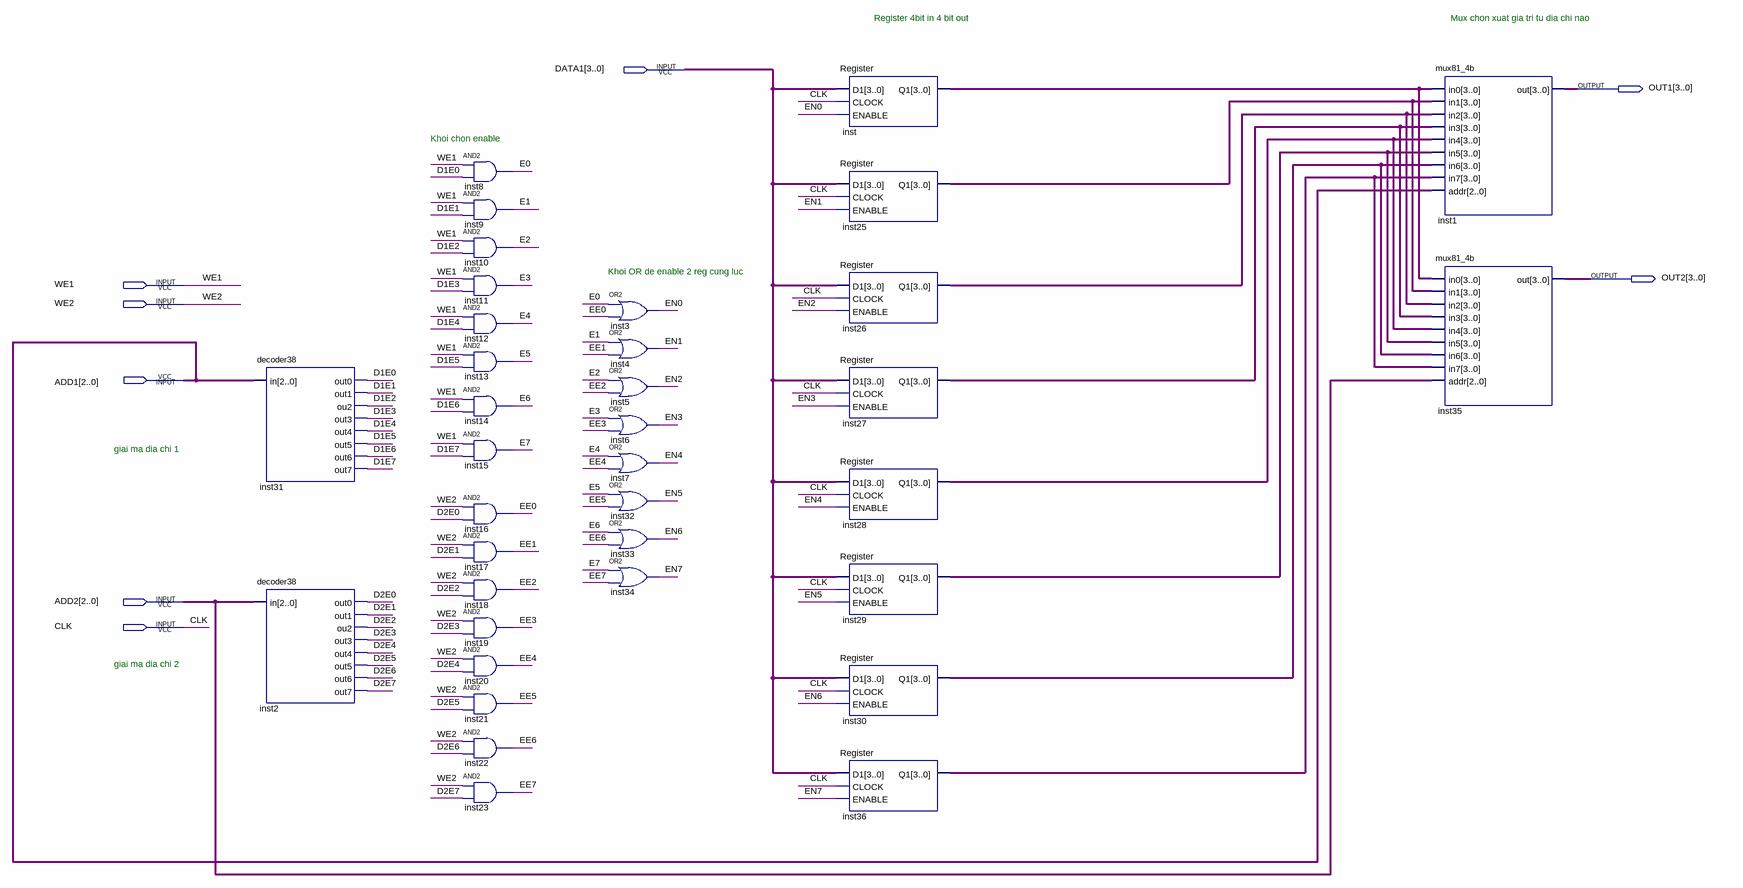
[diagram p0: schematic sheet]
// Quartus schematic Block3.bdf as structural Verilog: 36 symbols, 8 pins
module Block3 (
  input  [3:0] DATA1,
  input  WE1,
  input  WE2,
  input  [2:0] ADD1,
  input  [2:0] ADD2,
  input  CLK,
  output [3:0] OUT1,
  output [3:0] OUT2
);

  wire D1E0, D1E1, D1E2, D1E3, D1E4, D1E5, D1E6, D1E7, D2E0, D2E1, D2E2, D2E3, D2E4, D2E5, D2E6, D2E7, E0,
       E1, E2, E3, E4, E5, E6, E7, EE0, EE1, EE2, EE3, EE4, EE5, EE6, EE7, EN0, EN1, EN2, EN3, EN4, EN5, EN6,
       EN7;
  wire [3:0] inst25_q1, inst26_q1, inst27_q1, inst28_q1, inst29_q1, inst30_q1, inst36_q1, inst_q1;

  decoder38 inst31 (
    .in(ADD1), .out0(D1E0), .out1(D1E1), .ou2(D1E2), .out3(D1E3), .out4(D1E4), .out5(D1E5), .out6(D1E6),
    .out7(D1E7));
  decoder38 inst2 (
    .in(ADD2), .out0(D2E0), .out1(D2E1), .ou2(D2E2), .out3(D2E3), .out4(D2E4), .out5(D2E5), .out6(D2E6),
    .out7(D2E7));
  and inst8 (E0, WE1, D1E0);
  and inst9 (E1, WE1, D1E1);
  and inst10 (E2, WE1, D1E2);
  and inst11 (E3, WE1, D1E3);
  and inst12 (E4, WE1, D1E4);
  and inst13 (E5, WE1, D1E5);
  and inst14 (E6, WE1, D1E6);
  and inst15 (E7, WE1, D1E7);
  and inst16 (EE0, WE2, D2E0);
  and inst17 (EE1, WE2, D2E1);
  and inst18 (EE2, WE2, D2E2);
  and inst19 (EE3, WE2, D2E3);
  and inst20 (EE4, WE2, D2E4);
  and inst21 (EE5, WE2, D2E5);
  and inst22 (EE6, WE2, D2E6);
  and inst23 (EE7, WE2, D2E7);
  or inst3 (EN0, E0, EE0);
  or inst4 (EN1, E1, EE1);
  or inst5 (EN2, E2, EE2);
  or inst6 (EN3, E3, EE3);
  or inst7 (EN4, E4, EE4);
  or inst32 (EN5, E5, EE5);
  or inst33 (EN6, E6, EE6);
  or inst34 (EN7, E7, EE7);
  Register inst (.D1(DATA1), .CLOCK(CLK), .ENABLE(EN0), .Q1(inst_q1));
  Register inst25 (.D1(DATA1), .CLOCK(CLK), .ENABLE(EN1), .Q1(inst25_q1));
  Register inst26 (.D1(DATA1), .CLOCK(CLK), .ENABLE(EN2), .Q1(inst26_q1));
  Register inst27 (.D1(DATA1), .CLOCK(CLK), .ENABLE(EN3), .Q1(inst27_q1));
  Register inst28 (.D1(DATA1), .CLOCK(CLK), .ENABLE(EN4), .Q1(inst28_q1));
  Register inst29 (.D1(DATA1), .CLOCK(CLK), .ENABLE(EN5), .Q1(inst29_q1));
  Register inst30 (.D1(DATA1), .CLOCK(CLK), .ENABLE(EN6), .Q1(inst30_q1));
  Register inst36 (.D1(DATA1), .CLOCK(CLK), .ENABLE(EN7), .Q1(inst36_q1));
  mux81_4b inst1 (
    .in0(inst_q1), .in1(inst25_q1), .in2(inst26_q1), .in3(inst27_q1), .in4(inst28_q1), .in5(inst29_q1),
    .in6(inst30_q1), .in7(inst36_q1), .addr(ADD1), .out(OUT1));
  mux81_4b inst35 (
    .in0(inst_q1), .in1(inst25_q1), .in2(inst26_q1), .in3(inst27_q1), .in4(inst28_q1), .in5(inst29_q1),
    .in6(inst30_q1), .in7(inst36_q1), .addr(ADD2), .out(OUT2));

  // Notes on the sheet:
  //   Register 4bit in 4 bit out
  //   Mux chon xuat gia tri tu dia chi nao
  //   Khoi chon enable
  //   Khoi OR de enable 2 reg cung luc
  //   giai ma dia chi 1
  //   giai ma dia chi 2
endmodule
